# Altium schematic sheet Schema.SchDoc
size A3; Author: Meven Ricchieri; Organization: ETML-ES; Address1: Avenue Recordon 1; Address2: 1004 Lausanne; Address3: Switzerland; SheetNumber: 1; SheetTotal: 2; Version: 1.0.0
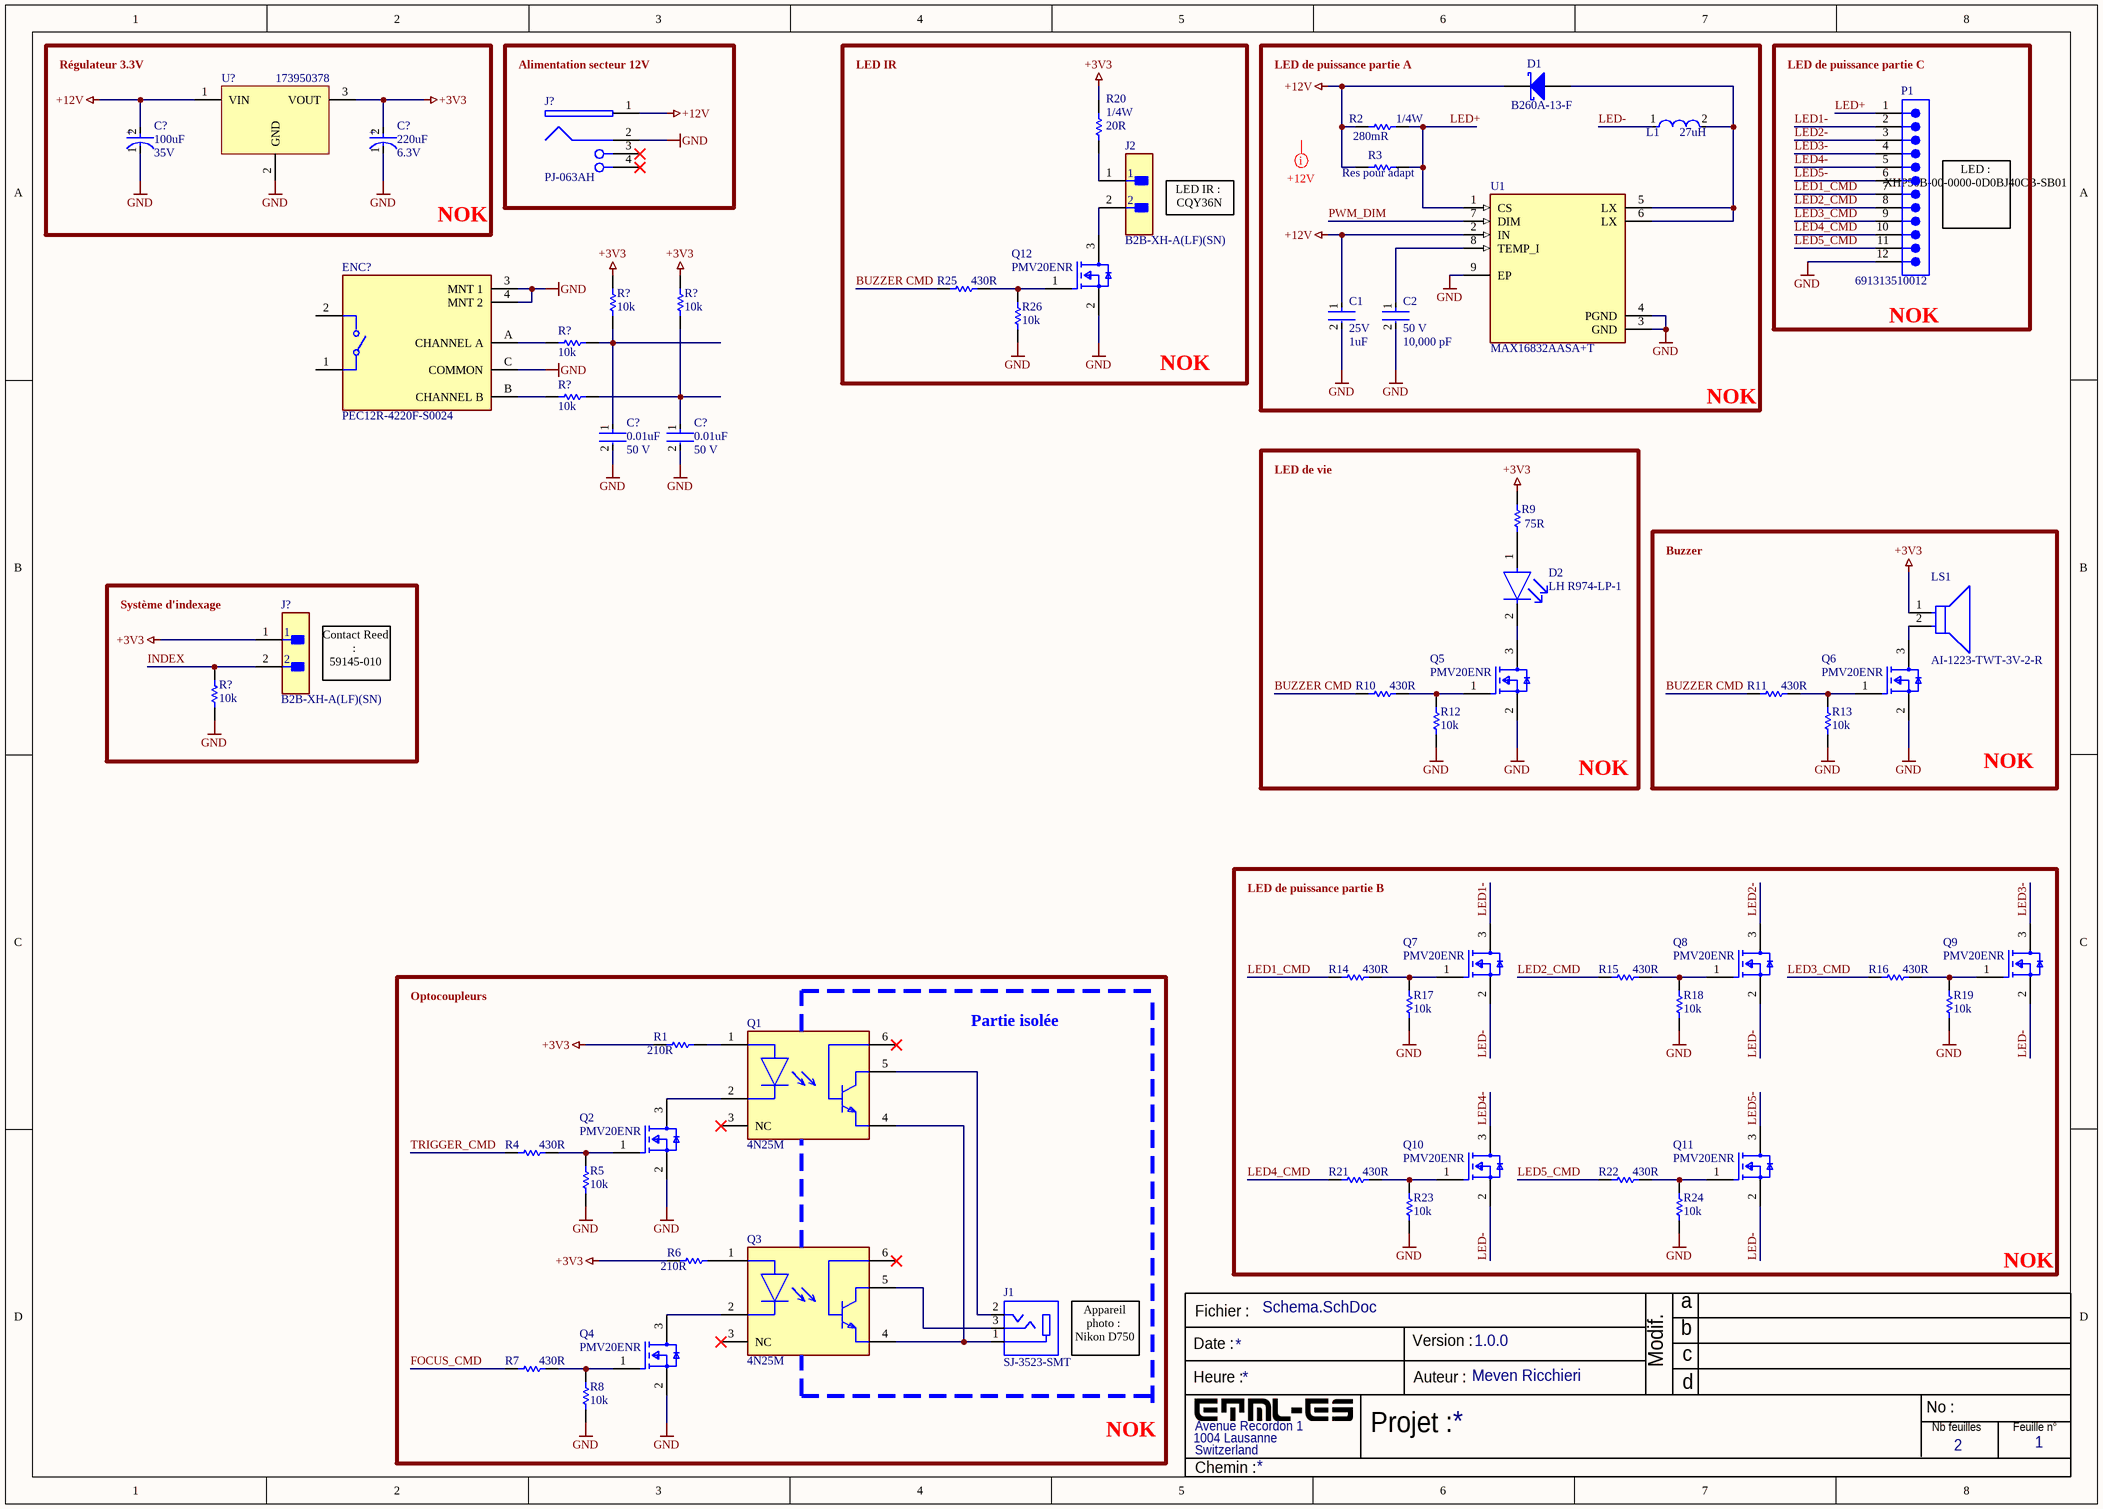
[diagram p0: Schema.SchDoc]

## Parts
(Parts that share a designator on the sheet are numbered #1, #2 ... from top to bottom, then left to right.)
C1  Voltage Rating: 25V  Capacitance: 1uF  [FP-CL21-IPC_B]  (hidden comment: CL21F105ZAFNNNF)
C2  value 10,000 pF  Voltage Rating: 50 V  [FP-C0805C-DN-MFG]  (hidden comment: C0805C103J5RAC7210)
C?#1  Capacitance: 100uF  Voltage: 35V  [FP-SD8-MFG]  (hidden comment: EEE-1VA101XP)
C?#2  Voltage Rating: 6.3V  Capacitance: 220uF  [FP-FKD-MFG]  (hidden comment: EEE-FK0J221P)
C?#3  value 0.01uF  Voltage Rating: 50 V  [FP-C0805C-DN-MFG]  (hidden comment: C0805C103J5RAC7210)
C?#4  value 0.01uF  Voltage Rating: 50 V  [FP-C0805C-DN-MFG]  (hidden comment: C0805C103J5RAC7210)
D1  B260A-13-F  [DIOD-SMA-2_V]
D2  LH R974-LP-1  [FP-LH_R974-MFG]
ENC?  PEC12R-4220F-S0024  [FP-PEC12R-4220F-S0024-MFG]
J1  SJ-3523-SMT  [CUI_SJ-3523-SMT]
J2  B2B-XH-A(LF)(SN)  [FP-B2B-XH-A_LF_SN-MFG]
J?#1  PJ-063AH  [CUI-PJ-063AH_V]
J?#2  B2B-XH-A(LF)(SN)  [FP-B2B-XH-A_LF_SN-MFG]
L1  value 27uH  [FP-SRR1260-MFG]  (hidden comment: SRR1260-270M)
LS1  AI-1223-TWT-3V-2-R  [FP-AI-1223-TWT-3V-2-R-MFG]
P1  691313510012  [691313510012]
Q1  4N25M  [FP-646BX-MFG]
Q2  PMV20ENR  [FP-SOT23-MFG]
Q3  4N25M  [FP-646BX-MFG]
Q4  PMV20ENR  [FP-SOT23-MFG]
Q5  PMV20ENR  [FP-SOT23-MFG]
Q6  PMV20ENR  [FP-SOT23-MFG]
Q7  PMV20ENR  [FP-SOT23-MFG]
Q8  PMV20ENR  [FP-SOT23-MFG]
Q9  PMV20ENR  [FP-SOT23-MFG]
Q10  PMV20ENR  [FP-SOT23-MFG]
Q11  PMV20ENR  [FP-SOT23-MFG]
Q12  PMV20ENR  [FP-SOT23-MFG]
R1  value 210R  [RESC2013X50X30NL20T20]  (hidden comment: CRCW0805210RFKEA)
R2  value 280mR  Puissance: 1/4W  [RESC3116X65X40ML10T20]  (hidden comment: RL1206FR-070R28L)
R3  Resistor  (value not drawn)
R4  value 430R  [RESC2013X60X35LL10T20]  (hidden comment: RC0805JR-07430RL)
R5  Resistance: 10k  [RESC2013X60X35ML10T20]  (hidden comment: RC0805JR-0710KL)
R6  value 210R  [RESC2013X50X30NL20T20]  (hidden comment: CRCW0805210RFKEA)
R7  value 430R  [RESC2013X60X35LL10T20]  (hidden comment: RC0805JR-07430RL)
R8  Resistance: 10k  [RESC2013X60X35ML10T20]  (hidden comment: RC0805JR-0710KL)
R9  value 75R  [RESC2013X60X35ML10T20]  (hidden comment: RC0805JR-0775RL)
R10  value 430R  [RESC2013X60X35LL10T20]  (hidden comment: RC0805JR-07430RL)
R11  value 430R  [RESC2013X60X35LL10T20]  (hidden comment: RC0805JR-07430RL)
R12  Resistance: 10k  [RESC2013X60X35ML10T20]  (hidden comment: RC0805JR-0710KL)
R13  Resistance: 10k  [RESC2013X60X35ML10T20]  (hidden comment: RC0805JR-0710KL)
R14  value 430R  [RESC2013X60X35LL10T20]  (hidden comment: RC0805JR-07430RL)
R15  value 430R  [RESC2013X60X35LL10T20]  (hidden comment: RC0805JR-07430RL)
R16  value 430R  [RESC2013X60X35LL10T20]  (hidden comment: RC0805JR-07430RL)
R17  Resistance: 10k  [RESC2013X60X35ML10T20]  (hidden comment: RC0805JR-0710KL)
R18  Resistance: 10k  [RESC2013X60X35ML10T20]  (hidden comment: RC0805JR-0710KL)
R19  Resistance: 10k  [RESC2013X60X35ML10T20]  (hidden comment: RC0805JR-0710KL)
R20  value 20R  Puissance: 1/4W  [RESC2013X60X30ML20T20]  (hidden comment: RK73B2ATTD200J)
R21  value 430R  [RESC2013X60X35LL10T20]  (hidden comment: RC0805JR-07430RL)
R22  value 430R  [RESC2013X60X35LL10T20]  (hidden comment: RC0805JR-07430RL)
R23  Resistance: 10k  [RESC2013X60X35ML10T20]  (hidden comment: RC0805JR-0710KL)
R24  Resistance: 10k  [RESC2013X60X35ML10T20]  (hidden comment: RC0805JR-0710KL)
R25  value 430R  [RESC2013X60X35LL10T20]  (hidden comment: RC0805JR-07430RL)
R26  Resistance: 10k  [RESC2013X60X35ML10T20]  (hidden comment: RC0805JR-0710KL)
R?#1  Resistance: 10k  [RESC2013X60X35ML10T20]  (hidden comment: RC0805JR-0710KL)
R?#2  Resistance: 10k  [RESC2013X60X35ML10T20]  (hidden comment: RC0805JR-0710KL)
R?#3  Resistance: 10k  [RESC2013X60X35ML10T20]  (hidden comment: RC0805JR-0710KL)
R?#4  Resistance: 10k  [RESC2013X60X35ML10T20]  (hidden comment: RC0805JR-0710KL)
R?#5  Resistance: 10k  [RESC2013X60X35ML10T20]  (hidden comment: RC0805JR-0710KL)
U1  MAX16832AASA+T  [SOIC127P600X168-9N]
U?  173950378  [WPME-FDSM_SIP-3_L11.6W8.5H10.5]

## Blocks framed on the sheet
NOK: C?#1 C?#2 U?
Alimentation secteur 12V: J?#1
NOK: J2 Q12 R20 R25 R26
NOK: C1 C2 D1 L1 R2 R3 U1
NOK: P1
NOK: D2 Q5 R9 R10 R12
NOK: LS1 Q6 R11 R13
Système d'indexage: J?#2 R?#5
NOK: Q7-Q11 R14-R19 R21-R24
NOK: J1 Q1-Q4 R1 R4-R8

## Nets
+3V3: C?#2.2(A) J?#2.1 LS1.1(C) R1.1 R6.1 R9.2 R20.2 R?#1.1 R?#2.1 U?.3(VOUT)
+12V: C1.1 C?#1.2(A) D1.2(K) J?#1.1 R2.1 R3.1 U1.2(IN) U?.1(VIN)
GND: C1.2 C2.2 C?#1.1(C) C?#2.1(C) C?#3.2 C?#4.2 ENC?.3(MNT_1) ENC?.4(MNT_2) ENC?.C(COMMON) J?#1.2 P1.12 Q2.2(S) Q4.2(S) Q5.2(S) Q6.2(S) Q12.2(S) R5.1 R8.1 R12.1 R13.1 R17.1 R18.1 R19.1 R23.1 R24.1 R26.1 R?#5.1 U1.3(GND) U1.4(PGND) U1.9(EP) U?.2(GND)
BUZZER CMD: R10.1 R11.1 R25.1
FOCUS_CMD: R7.1
INDEX: J?#2.2 R?#5.2
LED1-: P1.2 Q7.3(D)
LED1_CMD: P1.7 R14.1
LED2-: P1.3 Q8.3(D)
LED2_CMD: P1.8 R15.1
LED3-: P1.4 Q9.3(D)
LED3_CMD: P1.9 R16.1
LED4-: P1.5 Q10.3(D)
LED4_CMD: P1.10 R21.1
LED5-: P1.6 Q11.3(D)
LED5_CMD: P1.11 R22.1
LED+: P1.1 R2.2 R3.2 U1.1(CS)
LED-: L1.1 Q7.2(S) Q8.2(S) Q9.2(S) Q10.2(S) Q11.2(S)
PWM_DIM: U1.7(DIM)
TRIGGER_CMD: R4.1
NetC2_1: C2.1 U1.8(TEMP_I)
NetC?#3_1: C?#3.1 R?#1.2 R?#3.1
NetC?#4_1: C?#4.1 R?#2.2 R?#4.1
NetD1_1: D1.1(A) L1.2 U1.5(LX) U1.6(LX)
NetD2_1: D2.1(A) R9.1
NetD2_2: D2.2(C) Q5.3(D)
NetENC?_A: ENC?.A(CHANNEL_A) R?#3.2
NetENC?_B: ENC?.B(CHANNEL_B) R?#4.2
NetJ1_1: J1.1 Q1.4(E) Q3.4(E)
NetJ1_2: J1.2 Q1.5(C)
NetJ1_3: J1.3 Q3.5(C)
NetJ2_1: J2.1 R20.1
NetJ2_2: J2.2 Q12.3(D)
NetLS1_2: LS1.2(A) Q6.3(D)
NetQ1_1: Q1.1(A) R1.2
NetQ1_2: Q1.2(C) Q2.3(D)
NetQ2_1: Q2.1(G) R4.2 R5.2
NetQ3_1: Q3.1(A) R6.2
NetQ3_2: Q3.2(C) Q4.3(D)
NetQ4_1: Q4.1(G) R7.2 R8.2
NetQ5_1: Q5.1(G) R10.2 R12.2
NetQ6_1: Q6.1(G) R11.2 R13.2
NetQ7_1: Q7.1(G) R14.2 R17.2
NetQ8_1: Q8.1(G) R15.2 R18.2
NetQ9_1: Q9.1(G) R16.2 R19.2
NetQ10_1: Q10.1(G) R21.2 R23.2
NetQ11_1: Q11.1(G) R22.2 R24.2
NetQ12_1: Q12.1(G) R25.2 R26.2

Not connected (* = marked no-connect by the designer): ENC? 1 2; J?#1 3(SHLD)* 4(SHLD)*; Q1 3(NC)* 6(B)*; Q3 3(NC)* 6(B)*

## Layout directives
net class PowerLine: (no net found under the mark)

## Notes on the sheet
- Régulateur 3.3V
- LED IR
- LED de puissance partie A
- (near P1) LED de puissance partie C
- (near R3) Res pour adapt
- (near J2) LED IR :
  CQY36N
- (near P1) LED :
  XHP50B-00-0000-0D0BJ40CB-SB01
- LED de vie
- Buzzer
- (near J?#2) Contact Reed :
  59145-010
- LED de puissance partie B
- Optocoupleurs
- Partie isolée
- Appareil photo :
  Nikon D750
- Fichier :
- a
- Date :
- Heure :
- Version :
- Auteur :
- Modif.
- b
- c
- d
- Projet :
- No :
- Nb feuilles
- Feuille n°
- Chemin :
- (in symbol CMP-05427-000053-1) +
- (in symbol CMP-05427-000062-1) +

## Library data of the parts
C1 = CMP-13271-002018-1: CL21 Series 0805 1uF 25V -20/+80% Tolerance Y5V Multilayer Ceramic Chip Capacitor; Tolerance: 80%; Voltage Rating (DC): 25V; Thickness: 0.053inch; Radiation Hardening: No; Width: 0.049inch; Height: 1.25mm; Max Operating Temperature: 85°C; Mount: Surface Mount; Package Quantity: 10000; Depth: 1.25mm; Min Operating Temperature: -30°C; Packaging: Tape and Reel; Case/Package: 0805; Length: 2mm; Dielectric: Y5V
C2 = CMP-2007-01173-3: CAP CER SMD 0805 .01UF X7R 5% 50; Manufacturer: KEMET; Temperature Coefficient: 30ppm/°C; Tolerance: 0.05; Material: Ceramic; Digikey Description: CAP CER SMD 0805 .01UF X7R 5% 50; Temperature Characteristic: X7R; Manufacturer Part Number: C0805C103J5RAC7210; ComponentLink2URL: https://content.kemet.com/datasheets/KEM_C1003_C0G_SMD.pdf; ComponentLink2Description: Datasheet; Temperature Range High: +125°C; Package: C0805C-DN; Category: Cap; RoHS: TRUE; Device Class L1: Passive Components; Ipc Land Pattern Name: CAPC200125X78; Mouser Description: Cap Ceramic 0.01uF 50V X7R 5% Pad SMD 0805 125C T/R; Temperature: -55°C to +125°C; Octopart: https://octopart.com/c0805c103j5rac7210-kemet-3921106; Capacitance: 10,000 pF; Height: 0.88mm; Temperature Range Low: -55°C; Device Class L3: Ceramic Capacitors; Device Class L2: Capacitors; Lead Free: Yes; Automotive: No
C?#1 = CMP-05427-000062-1: CAP ALUM 100UF 20% 35V SMD; Ripple Current (AC): 132mA; Leakage Current: 3uA; Life (Hours): 2000Hour; Polarity: Polar; Lead Free: Lead Free; REACH SVHC: No SVHC; Number of Pins: 8; Contact Plating: Tin; Construction: Cylindrical; Min Operating Temperature: -40°C; Tolerance: 20%; Mount: Surface Mount; Series: S; Radiation Hardening: No; Package Quantity: 900; RoHS Compliant: Yes; Case/Package: Radial; Height - Seated (Max): 0.303inch; Voltage Rating: 35V; Voltage Rating (DC): 35V; Length: 8mm; Height: 7.7mm; Max Operating Temperature: 85°C; Packaging: Tape and Reel; Termination: SMD/SMT; Ripple Current: 132mA; Diameter: 6.3mm
C?#2 = CMP-05427-000053-1: CAP ALUM 220UF 20% 6.3V SMD; Material: Aluminium; Leakage Current: 3uA; Ripple Current: 240mA; ESR (Equivalent Series Resistance): 360mR; Polarity: Polar; Life (Hours): 2000Hour; Case/Package: Radial; Packaging: Tape and Reel; Height - Seated (Max): 0.24inch; Construction: Cylindrical; Radiation Hardening: No; Number of Pins: 2; Diameter: 6.3mm; Width: 7.8mm; Length: 5.8mm; Ripple Current (AC): 240mA; Voltage: 6.3V; Height: 5.8mm; Termination: SMD/SMT; Series: FK; Contact Plating: Tin; Mount: Surface Mount; Voltage Rating (DC): 6.3V; Size: 5.8mm; Min Operating Temperature: -55°C; Package Quantity: 1000; Tolerance: 20%; REACH SVHC: No SVHC; Impedance: 360mR; Lead Free: Lead Free; RoHS Compliant: Yes; Max Operating Temperature: 105°C
C?#3 C?#4 = CMP-2007-01173-3: CAP CER SMD 0805 .01UF X7R 5% 50; Manufacturer: KEMET; Description: C0805 10,000 pF X7R 30ppm/°C 5.00% 50 V; Temperature Coefficient: 30ppm/°C; Tolerance: 0.05; Capacitance: 10,000 pF; Material: Ceramic; Digikey Description: CAP CER SMD 0805 .01UF X7R 5% 50; Temperature Characteristic: X7R; Manufacturer Part Number: C0805C103J5RAC7210; ComponentLink2URL: https://content.kemet.com/datasheets/KEM_C1003_C0G_SMD.pdf; ComponentLink2Description: Datasheet; Temperature Range High: +125°C; Package: C0805C-DN; Category: Cap; RoHS: TRUE; Device Class L1: Passive Components; Ipc Land Pattern Name: CAPC200125X78; Mouser Description: Cap Ceramic 0.01uF 50V X7R 5% Pad SMD 0805 125C T/R; Temperature: -55°C to +125°C; Octopart: https://octopart.com/c0805c103j5rac7210-kemet-3921106; Height: 0.88mm; Temperature Range Low: -55°C; Device Class L3: Ceramic Capacitors; Device Class L2: Capacitors; Lead Free: Yes; Automotive: No
D1 = CMP-2000-04933-1: Schottky Barrier Rectifier, 60 V, 2 A, -65 to 150 degC, 2-Pin SMA, RoHS, Tape and Reel; If - Forward Current: 2A; Vf - Forward Voltage: 0.7V; Ir - Reverse Current: 500uA; Configuration: Single; Unit Weight: 0.002258oz; Brand: DiodesIncorporated; Vrrm - Repetitive Reverse Voltage: 60V; Ifsm - Forward Surge Current: 50A; Product Category: SchottkyDiodes&Rectifiers; Datasheet Version: Rev. 22-2, 07/2015; Maximum Operating Temperature: +150C; Product: SchottkyDiodes; Minimum Operating Temperature: -65C; Operating Temperature Range: -65Cto+150C; Termination Style: SMD/SMT; Package / Case: SMA; Factory Pack Quantity: 5000; Technology: Si; Height: 2.1mm; Type: SchottkyBarrierRectifier; Manufacturer URL: http://www.diodes.com/; Datasheet URL: http://www.diodes.com/_files/datasheets/ds13004.pdf; RoHS: True; Mounting Style: SMD/SMT; Length: 4.6mm; Series: B260; Package Reference: SMA-2; Packaging: Reel; Width: 2.92mm; Manufacturer: DiodesIncorporated; Package Description: 2-Pin Surface Mounted Assembly, Body 4.3 x 2.605 mm, Height 2.4 mm
D2 = CMP-2000-06540-2: LED RED DIFFUSED 0805 SMD; Number of Elements: 1; Forward Voltage: 2.6V; Viewing Angle: 160°; Reverse Voltage: 5V; Test Current: 20mA; Dominant Wavelength: 645nm; Forward Current: 30mA; Luminous Intensity: 15mcd; Depth: 1.35mm; Min Operating Temperature: -30°C; Length: 2.1mm; Max Operating Temperature: 85°C; Radiation Hardening: No; Packaging: Tape and Reel; Number of Pins: 2; Mount: Surface Mount; Lens Style: Diffused
ENC? = CMP-07421-000021-1: ROTARY ENCODER MECHANICAL 24PPR; Built in Switch: Yes; Pulses per Revolution: 24; Output Type: Quadrature; Hole Diameter: 2mm; Number of Channels: 2; Max Supply Voltage (DC): 5V; RoHS Compliant: Yes; Max Operating Temperature: 70°C; Length: 26mm; Width: 12.5mm; Encoder Type: Mechanical; Series: PEC12R; Mount: Through Hole; Height: 13.4mm; Packaging: Bulk; Package Quantity: 150; Termination: PC Pin; Min Operating Temperature: -30°C; REACH SVHC: No SVHC; Detent: Yes; Orientation: Vertical
J2 J?#2 = CMP-2000-05888-3: CONN HEADER VERT 2POS 2.5MM; Current Rating: 3A; Voltage Rating: 250V; Number of Contacts: 2; Contact Resistance: 20mR; Wire/Cable Gauge: 22AWG; Insulation Resistance: 1GR; Connector Type: Male Pin; Packaging: Bulk; Contact Material: Brass; Lead Free: Lead Free; Orientation: Straight; Contact Plating: Tin; Max Current Rating: 3A; Termination: Solder; Fastening Type: Detent; Depth: 5.75mm; Housing Material: Polyamide; REACH SVHC: No SVHC; Series: XH; Voltage Rating (AC): 250V; Number of Positions: 2; Color: Natural; Contact Type: Male Pin; Max Voltage Rating (DC): 250V; Pitch: 2.5mm; Lead Pitch: 2.5mm; Mount: Through Hole; Max Operating Temperature: 85°C; Length: 7.4mm; Max Voltage Rating (AC): 250V; Min Operating Temperature: -25°C; Number of Rows: 1; Housing Color: White
J?#1 = CMP-2000-06898-1: Through Hole Right Angle DC Power Jack, 8 A, 2 mm Center Pin, 2 Position, -25 to 85 degC, RoHS, Bulk; Manufacturer: CUIInc.; Voltage Rating: 24V; Current Rating: 8A; Inside Contact Diameter: 2mm; Insulation Resistance: 100MOhms; Outside Contact Diameter: 6.5mm; Brand: CUI; Termination Style: ThroughHole; Flammability Rating: UL94V-0; Datasheet Version: Rev. 1.02, 03/2016; Manufacturer URL: http://www.cui.com/; Product Category: DCPowerConnectors; Package Description: 2-Pin Through Hole Device, Body 13 x 10 mm, Height 9 mm; Connector Type: DCPowerJack; Factory Pack Quantity: 500; Contact Plating: Nickel; Mounting Style: KinkedPin; Contact Material: Copper; RoHS: True; Mounting Angle: Right; Package Reference: PJ-063AH; Product: Jacks; Contact Gender: Male; Datasheet URL: http://www.cui.com/product/resource/pj-063ah.pdf; Housing Material: PolybutyleneTerephthalate(PBT); Mounting Technology: ThroughHole; Operating Temperature Range: -25Cto+85C
L1 = CMP-07248-000018-1: FIXED IND 27UH 3.6A 45 MOHM SMD; Manufacturer: Bourns; Tolerance: 20%; Core Material: Ferrite; Q Factor: 26; Series Resistance: 45mΩ; Saturation Current: 3.3A; Self Resonant Frequency: 12.7MHz; Test Frequency: 2.52MHz; ComponentLink2URL: https://www.bourns.com/docs/product-datasheets/srr1260.pdf?sfvrsn=a4409aa5_15; Mouser Description: Fixed Inductors 27uH 20% SMD 1260; Temperature Range Low: -40°C; Manufacturer Part Number: SRR1260-270M; Temperature Range High: +125°C; ComponentLink2Description: Datasheet; Lead Free: Yes; Device Class L1: Passive Components; Height: 6.5mm; Rms Current: 3.6A; Category: Ind; Device Class L2: Inductors; Composition: Wirewound; RoHS: TRUE; Automotive: No; Digikey Description: FIXED IND 27UH 3.6A 45 MOHM SMD; Package: SRR1260; Device Class L3: Fixed Inductors; Inductance: 27uH; Octopart: https://octopart.com/srr1260-270m-bourns-1930921; Temperature: -40°C to +125°C
LS1 = CMP-103888-000003-1: BUZZER MAGNETIC 3V 12MM TH; Min Supply Voltage (DC): 2V; Operating Supply Current: 30mA; Max Supply Voltage (DC): 4V; Input Type: DC; Frequency: 2.3kHz; Series: AI; Nominal Supply Voltage (DC): 3V; Packaging: Tray; Max Operating Temperature: 70°C; Height: 7.5mm; Termination: PC Pins; Max Supply Current: 30mA; Mount: Through Hole; Diameter: 12mm; Voltage Rating: 3V; Sensing Method: Magnetic; Min Operating Temperature: -20°C; Contact Plating: Tin
P1 = CMP-1502-02202-2: NexarPartId: 105951017
Q1 Q3 = CMP-00278-84323282-1: 4N25M Optocoupler DC-IN 1-CH Transistor With Base DC-OUT 6-Pin PDIP Tube - Bulk; Manufacturer Lifecycle Status: ACTIVE; Isolation Voltage: 7.5kV; Number of Circuits: 1; Collector Emitter Voltage (VCEO): 500mV; Max Junction Temperature (Tj): 125°C; Collector Emitter Breakdown Voltage: 30V; Forward Current: 10mA; Max Input Current: 50mA; Turn-Off Delay Time: 2µs; Current Transfer Ratio: 20%; Reverse Voltage: 6V; Power Dissipation: 250mW; Max Power Dissipation: 200mW; Approvals: UL; Forward Voltage: 1.18V; Max Operating Temperature: 100°C; Min Operating Temperature: -55°C; RoHS: Compliant; Lifecycle Status: Production; NexarPartId: 84323282; Weight: 855mg; Reverse Breakdown Voltage: 6V; Rise Time: 2µs; Case/Package: DIP; Max Output Voltage: 30V; Number of Elements: 1; Output Voltage: 30V; Mount: Through Hole; REACH SVHC: No SVHC; Length: 7.12mm; Input Current: 10mA; Collector Emitter Saturation Voltage: 500mV; Width: 6.5mm; Schedule B: 8541408000, 8541408000; Height: 5.08mm; Turn-On Delay Time: 2µs; Number of Pins: 6; Fall Time: 2µs; Radiation Hardening: No; Lead Free: Lead Free; Number of Channels: 1
Q2 Q4-Q12 = CMP-14409-000013-1: MOSFET N-CH 30V SOT23
R1 R6 = CMP-1013-00431-2: Manufacturer: Vishay Dale; Part Number: CRCW0805210RFKEA
R2 = CMP-2003-04069-1: Manufacturer: Yageo; Part Number: RL1206FR-070R28L
R3 = Resistor: TC1: 0; SimulationGenericComponent: True; TC2: 0
R4 R7 R10 R11 R14-R16 R21 R22 R25 = CMP-2001-01382-1: Manufacturer: Yageo; Part Number: RC0805JR-07430RL
R5 R8 R12 R13 R17-R19 R23 R24 R26 R?#1-R?#5 = CMP-2000-05025-1: Chip Resistor, 10 KOhm, +/- 5%, 0.125 W, -55 to 155 degC, 0805 (2012 Metric), RoHS, Tape and Reel; Manufacturer: Yageo; Resistor Element Type: ThickFilm; Voltage Rating: 150V; Product Range: RCSeries; SVHC: ToBeAdvised; Resistor Case Style: 0805[2012Metric]; Temperature Coefficient: ±100ppm/degC; Power Rating: 250mW; Automotive Qualification Standard: -; Datasheet Version: REV. 2, 09/2004; Packaging: CutTape; Resistance Tolerance: ±5%; MSL: MSL1-Unlimited; Manufacturer URL: http://www.yageo.com/; Datasheet URL: http://www.yageo.ru/pdf/RC0805.pdf; Package Description: 2-Pin Surface Mounted Device, Body 2 x 1.25 mm; Package Reference: 805
R9 = CMP-2001-01402-1: Manufacturer: Yageo; Part Number: RC0805JR-0775RL
R20 = CMP-2001-01797-1: Manufacturer: KOA Speer; Part Number: RK73B2ATTD200J
U? = CMP-03913-65436605-1: 173950378 Module DC-DC 1-OUT 3.3V 0.5A 3-Pin SIP Module Tube; Output Power: 1.65W; Max Input Voltage: 28V; Number of Outputs: 1; Min Input Voltage: 6V; Switching Frequency: 570kHz; Max Output Current: 500mA; Efficiency: 95%; Output Type: Fixed; RoHS: Compliant; Features: OTP, OVP, SCP; REACH SVHC: Unknown; Width: 8.5mm; Length: 11.6mm; Min Operating Temperature: -40°C; Case/Package: Module; Output Voltage: 3.3V; Max Power Dissipation: 1.65W; NexarPartId: 65436605; Number of Pins: 3; Voltage - Output 1: 3.3V; Max Operating Temperature: 85°C; Max Switching Frequency: 570kHz; Max Output Voltage: 3.3V; Height: 10.5mm; Mount: Through Hole; Output Current: 500mA; Nominal Output Voltage: 3.3V